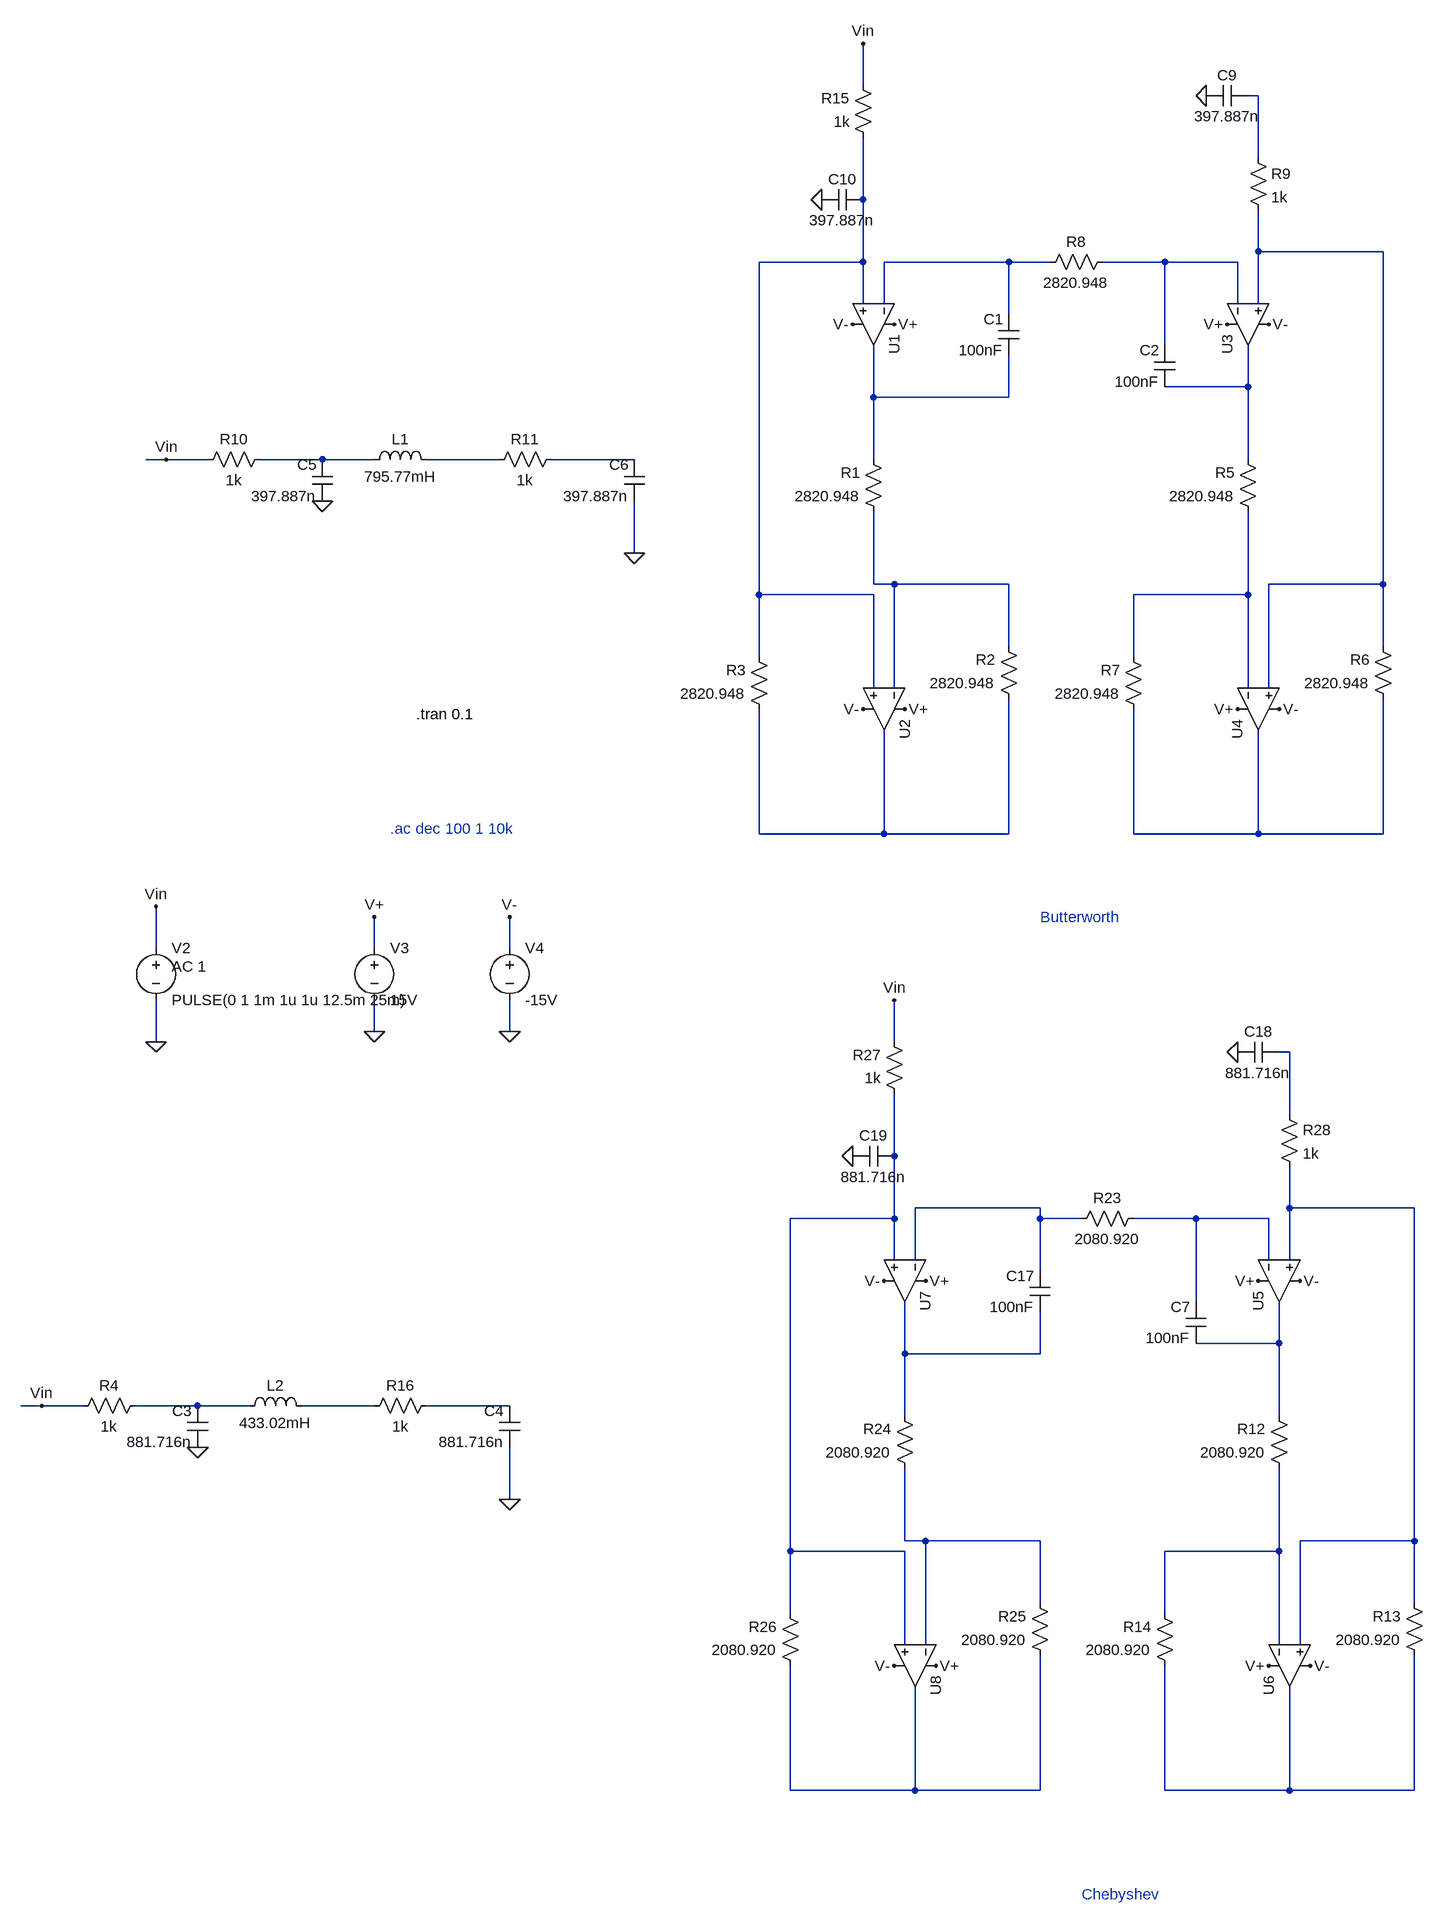
[diagram p0: schematic comparatie-impedanta.asc]
comparatie-impedanta.asc, the LTspice schematic file:
Version 4.1
SHEET 1 3224 1560
WIRE 240 -1312 240 -1376
WIRE 848 -1296 832 -1296
WIRE 848 -1200 848 -1296
WIRE 240 -1136 240 -1232
WIRE 848 -1056 848 -1120
WIRE 1040 -1056 848 -1056
WIRE 240 -1040 240 -1136
WIRE 240 -1040 80 -1040
WIRE 464 -1040 272 -1040
WIRE 528 -1040 464 -1040
WIRE 704 -1040 608 -1040
WIRE 816 -1040 704 -1040
WIRE 240 -976 240 -1040
WIRE 272 -976 272 -1040
WIRE 816 -976 816 -1040
WIRE 848 -976 848 -1056
WIRE 464 -960 464 -1040
WIRE 704 -912 704 -1040
WIRE 832 -848 832 -912
WIRE 832 -848 704 -848
WIRE 256 -832 256 -912
WIRE 464 -832 464 -896
WIRE 464 -832 256 -832
WIRE -832 -736 -864 -736
WIRE -768 -736 -832 -736
WIRE -592 -736 -688 -736
WIRE -512 -736 -592 -736
WIRE -320 -736 -432 -736
WIRE -112 -736 -240 -736
WIRE 256 -736 256 -832
WIRE 832 -736 832 -848
WIRE -112 -592 -112 -672
WIRE 256 -544 256 -656
WIRE 288 -544 256 -544
WIRE 464 -544 288 -544
WIRE 1040 -544 1040 -1056
WIRE 1040 -544 864 -544
WIRE 80 -528 80 -1040
WIRE 256 -528 80 -528
WIRE 832 -528 832 -656
WIRE 832 -528 656 -528
WIRE 464 -448 464 -544
WIRE 1040 -448 1040 -544
WIRE 80 -432 80 -528
WIRE 656 -432 656 -528
WIRE 256 -384 256 -528
WIRE 288 -384 288 -544
WIRE 832 -384 832 -528
WIRE 864 -384 864 -544
WIRE 80 -160 80 -352
WIRE 272 -160 272 -320
WIRE 272 -160 80 -160
WIRE 464 -160 464 -368
WIRE 464 -160 272 -160
WIRE 656 -160 656 -352
WIRE 848 -160 848 -320
WIRE 848 -160 656 -160
WIRE 1040 -160 1040 -368
WIRE 1040 -160 848 -160
WIRE -848 16 -848 -48
WIRE -512 16 -512 -32
WIRE -304 16 -304 -32
WIRE -512 144 -512 96
WIRE -304 144 -304 96
WIRE -848 160 -848 96
WIRE 288 160 288 96
WIRE 896 176 880 176
WIRE 896 272 896 176
WIRE 288 336 288 240
WIRE 512 416 320 416
WIRE 896 416 896 352
WIRE 1088 416 896 416
WIRE 288 432 288 336
WIRE 288 432 128 432
WIRE 512 432 512 416
WIRE 576 432 512 432
WIRE 752 432 656 432
WIRE 864 432 752 432
WIRE 288 496 288 432
WIRE 320 496 320 416
WIRE 864 496 864 432
WIRE 896 496 896 416
WIRE 512 512 512 432
WIRE 752 560 752 432
WIRE 880 624 880 560
WIRE 880 624 752 624
WIRE 304 640 304 560
WIRE 512 640 512 576
WIRE 512 640 304 640
WIRE -1024 720 -1056 720
WIRE -960 720 -1024 720
WIRE -784 720 -880 720
WIRE -704 720 -784 720
WIRE -512 720 -624 720
WIRE -304 720 -432 720
WIRE 304 736 304 640
WIRE 880 736 880 624
WIRE -304 864 -304 784
WIRE 304 928 304 816
WIRE 336 928 304 928
WIRE 512 928 336 928
WIRE 1088 928 1088 416
WIRE 1088 928 912 928
WIRE 128 944 128 432
WIRE 304 944 128 944
WIRE 880 944 880 816
WIRE 880 944 704 944
WIRE 512 1024 512 928
WIRE 1088 1024 1088 928
WIRE 128 1040 128 944
WIRE 704 1040 704 944
WIRE 304 1088 304 944
WIRE 336 1088 336 928
WIRE 880 1088 880 944
WIRE 912 1088 912 928
WIRE 128 1312 128 1120
WIRE 320 1312 320 1152
WIRE 320 1312 128 1312
WIRE 512 1312 512 1104
WIRE 512 1312 320 1312
WIRE 704 1312 704 1120
WIRE 896 1312 896 1152
WIRE 896 1312 704 1312
WIRE 1088 1312 1088 1104
WIRE 1088 1312 896 1312
FLAG -512 144 0
FLAG -304 144 0
FLAG -512 -32 V+
FLAG -304 -32 V-
FLAG -112 -592 0
FLAG 816 -352 V+
FLAG 800 -944 V+
FLAG 880 -352 V-
FLAG 864 -944 V-
FLAG 304 -352 V+
FLAG 288 -944 V+
FLAG 240 -352 V-
FLAG 224 -944 V-
FLAG 768 -1296 0
FLAG 176 -1136 0
FLAG -592 -672 0
FLAG 240 -1376 Vin
FLAG -848 160 0
FLAG -848 -48 Vin
FLAG -832 -736 Vin
FLAG 864 1120 V+
FLAG 848 528 V+
FLAG 928 1120 V-
FLAG 912 528 V-
FLAG 352 1120 V+
FLAG 336 528 V+
FLAG 288 1120 V-
FLAG 272 528 V-
FLAG 816 176 0
FLAG 224 336 0
FLAG 288 96 Vin
FLAG -304 864 0
FLAG -784 784 0
FLAG -1024 720 Vin
SYMBOL voltage -512 0 R0
WINDOW 123 0 0 Left 0
WINDOW 39 0 0 Left 0
SYMATTR InstName V3
SYMATTR Value 15V
SYMBOL voltage -304 0 R0
WINDOW 123 0 0 Left 0
WINDOW 39 0 0 Left 0
SYMATTR InstName V4
SYMATTR Value -15V
SYMBOL ind -528 -720 R270
WINDOW 0 32 56 VTop 2
WINDOW 3 5 56 VBottom 2
SYMATTR InstName L1
SYMATTR Value 795.77mH
SYMBOL res 848 -640 R180
WINDOW 0 36 76 Left 2
WINDOW 3 36 40 Left 2
SYMATTR InstName R5
SYMATTR Value 2820.948
SYMBOL res 1056 -352 R180
WINDOW 0 36 76 Left 2
WINDOW 3 36 40 Left 2
SYMATTR InstName R6
SYMATTR Value 2820.948
SYMBOL res 672 -336 R180
WINDOW 0 36 76 Left 2
WINDOW 3 36 40 Left 2
SYMATTR InstName R7
SYMATTR Value 2820.948
SYMBOL res 624 -1056 R90
WINDOW 0 0 56 VBottom 2
WINDOW 3 32 56 VTop 2
SYMATTR InstName R8
SYMATTR Value 2820.948
SYMBOL cap 720 -848 R180
WINDOW 0 24 56 Left 2
WINDOW 3 24 8 Left 2
SYMATTR InstName C2
SYMATTR Value 100nF
SYMBOL OpAmps\\UniversalOpAmp2 832 -944 M90
SYMATTR InstName U3
SYMBOL cap -576 -672 R180
WINDOW 0 24 56 Left 2
WINDOW 3 24 8 Left 2
SYMATTR InstName C5
SYMATTR Value 397.887n
SYMBOL cap -96 -672 R180
WINDOW 0 24 56 Left 2
WINDOW 3 24 8 Left 2
SYMATTR InstName C6
SYMATTR Value 397.887n
SYMBOL OpAmps\\UniversalOpAmp2 848 -352 M90
SYMATTR InstName U4
SYMBOL res 272 -640 R180
WINDOW 0 36 76 Left 2
WINDOW 3 36 40 Left 2
SYMATTR InstName R1
SYMATTR Value 2820.948
SYMBOL res 480 -352 R180
WINDOW 0 36 76 Left 2
WINDOW 3 36 40 Left 2
SYMATTR InstName R2
SYMATTR Value 2820.948
SYMBOL res 96 -336 R180
WINDOW 0 36 76 Left 2
WINDOW 3 36 40 Left 2
SYMATTR InstName R3
SYMATTR Value 2820.948
SYMBOL cap 480 -896 R180
WINDOW 0 24 56 Left 2
WINDOW 3 24 8 Left 2
SYMATTR InstName C1
SYMATTR Value 100nF
SYMBOL OpAmps\\UniversalOpAmp2 256 -944 R90
SYMATTR InstName U1
SYMBOL OpAmps\\UniversalOpAmp2 272 -352 R90
SYMATTR InstName U2
SYMBOL res 256 -1216 R180
WINDOW 0 36 76 Left 2
WINDOW 3 36 40 Left 2
SYMATTR InstName R15
SYMATTR Value 1k
SYMBOL cap 832 -1312 R90
WINDOW 0 0 32 VBottom 2
WINDOW 3 32 32 VTop 2
SYMATTR InstName C9
SYMATTR Value 397.887n
SYMBOL cap 240 -1152 R90
WINDOW 0 0 32 VBottom 2
WINDOW 3 32 32 VTop 2
SYMATTR InstName C10
SYMATTR Value 397.887n
SYMBOL voltage -848 0 R0
WINDOW 123 24 44 Left 2
WINDOW 39 0 0 Left 0
SYMATTR Value2 AC 1
SYMATTR InstName V2
SYMATTR Value PULSE(0 1 1m 1u 1u 12.5m 25m)
SYMBOL res 832 -1216 R0
SYMATTR InstName R9
SYMATTR Value 1k
SYMBOL res -672 -752 R90
WINDOW 0 0 56 VBottom 2
WINDOW 3 32 56 VTop 2
SYMATTR InstName R10
SYMATTR Value 1k
SYMBOL res -224 -752 R90
WINDOW 0 0 56 VBottom 2
WINDOW 3 32 56 VTop 2
SYMATTR InstName R11
SYMATTR Value 1k
SYMBOL res 896 832 R180
WINDOW 0 36 76 Left 2
WINDOW 3 36 40 Left 2
SYMATTR InstName R12
SYMATTR Value 2080.920
SYMBOL res 1104 1120 R180
WINDOW 0 36 76 Left 2
WINDOW 3 36 40 Left 2
SYMATTR InstName R13
SYMATTR Value 2080.920
SYMBOL res 720 1136 R180
WINDOW 0 36 76 Left 2
WINDOW 3 36 40 Left 2
SYMATTR InstName R14
SYMATTR Value 2080.920
SYMBOL res 672 416 R90
WINDOW 0 0 56 VBottom 2
WINDOW 3 32 56 VTop 2
SYMATTR InstName R23
SYMATTR Value 2080.920
SYMBOL cap 768 624 R180
WINDOW 0 24 56 Left 2
WINDOW 3 24 8 Left 2
SYMATTR InstName C7
SYMATTR Value 100nF
SYMBOL OpAmps\\UniversalOpAmp2 880 528 M90
SYMATTR InstName U5
SYMBOL OpAmps\\UniversalOpAmp2 896 1120 M90
SYMATTR InstName U6
SYMBOL res 320 832 R180
WINDOW 0 36 76 Left 2
WINDOW 3 36 40 Left 2
SYMATTR InstName R24
SYMATTR Value 2080.920
SYMBOL res 528 1120 R180
WINDOW 0 36 76 Left 2
WINDOW 3 36 40 Left 2
SYMATTR InstName R25
SYMATTR Value 2080.920
SYMBOL res 144 1136 R180
WINDOW 0 36 76 Left 2
WINDOW 3 36 40 Left 2
SYMATTR InstName R26
SYMATTR Value 2080.920
SYMBOL cap 528 576 R180
WINDOW 0 24 56 Left 2
WINDOW 3 24 8 Left 2
SYMATTR InstName C17
SYMATTR Value 100nF
SYMBOL OpAmps\\UniversalOpAmp2 304 528 R90
SYMATTR InstName U7
SYMBOL OpAmps\\UniversalOpAmp2 320 1120 R90
SYMATTR InstName U8
SYMBOL res 304 256 R180
WINDOW 0 36 76 Left 2
WINDOW 3 36 40 Left 2
SYMATTR InstName R27
SYMATTR Value 1k
SYMBOL cap 880 160 R90
WINDOW 0 0 32 VBottom 2
WINDOW 3 32 32 VTop 2
SYMATTR InstName C18
SYMATTR Value 881.716n
SYMBOL cap 288 320 R90
WINDOW 0 0 32 VBottom 2
WINDOW 3 32 32 VTop 2
SYMATTR InstName C19
SYMATTR Value 881.716n
SYMBOL res 880 256 R0
SYMATTR InstName R28
SYMATTR Value 1k
SYMBOL ind -720 736 R270
WINDOW 0 32 56 VTop 2
WINDOW 3 5 56 VBottom 2
SYMATTR InstName L2
SYMATTR Value 433.02mH
SYMBOL cap -768 784 R180
WINDOW 0 24 56 Left 2
WINDOW 3 24 8 Left 2
SYMATTR InstName C3
SYMATTR Value 881.716n
SYMBOL cap -288 784 R180
WINDOW 0 24 56 Left 2
WINDOW 3 24 8 Left 2
SYMATTR InstName C4
SYMATTR Value 881.716n
SYMBOL res -864 704 R90
WINDOW 0 0 56 VBottom 2
WINDOW 3 32 56 VTop 2
SYMATTR InstName R4
SYMATTR Value 1k
SYMBOL res -416 704 R90
WINDOW 0 0 56 VBottom 2
WINDOW 3 32 56 VTop 2
SYMATTR InstName R16
SYMATTR Value 1k
TEXT -488 -168 Left 2 ;.ac dec 100 1 10k
TEXT 512 -32 Left 2 ;Butterworth
TEXT 576 1472 Left 2 ;Chebyshev
TEXT -448 -344 Left 2 !.tran 0.1

The netlist it stands for:
* comparatie-impedanta.asc
V3 V+ 0 15V
V4 V- 0 -15V
L1 N008 N009 795.77mH
R5 N012 N006 2820.948
R6 N014 N003 2820.948
R7 N014 N012 2820.948
R8 N005 N004 2820.948
C2 N006 N005 100nF
X§U3 N003 N005 V+ V- N006 level2 Avol=1Meg GBW=10Meg Slew=10Meg Ilimit=25m Rail=0 Vos=0 En=0 Enk=0 In=0 Ink=0 Rin=500Meg  ; pins In+ In- V+ V- OUT
C5 0 N008 397.887n
C6 0 N010 397.887n
X§U4 N003 N012 V+ V- N014 level2 Avol=1Meg GBW=10Meg Slew=10Meg Ilimit=25m Rail=0 Vos=0 En=0 Enk=0 In=0 Ink=0 Rin=500Meg  ; pins In+ In- V+ V- OUT
R1 N011 N007 2820.948
R2 N013 N011 2820.948
R3 N013 N002 2820.948
C1 N007 N004 100nF
X§U1 N002 N004 V+ V- N007 level2 Avol=1Meg GBW=10Meg Slew=10Meg Ilimit=25m Rail=0 Vos=0 En=0 Enk=0 In=0 Ink=0 Rin=500Meg  ; pins In+ In- V+ V- OUT
X§U2 N002 N011 V+ V- N013 level2 Avol=1Meg GBW=10Meg Slew=10Meg Ilimit=25m Rail=0 Vos=0 En=0 Enk=0 In=0 Ink=0 Rin=500Meg  ; pins In+ In- V+ V- OUT
R15 N002 Vin 1k
C9 N001 0 397.887n
C10 N002 0 397.887n
V2 Vin 0 PULSE(0 1 1m 1u 1u 12.5m 25m) AC 1
R9 N001 N003 1k
R10 N008 Vin 1k
R11 N010 N009 1k
R12 N026 N020 2080.920
R13 N028 N018 2080.920
R14 N028 N026 2080.920
R23 N019 N017 2080.920
C7 N020 N019 100nF
X§U5 N018 N019 V+ V- N020 level2 Avol=1Meg GBW=10Meg Slew=10Meg Ilimit=25m Rail=0 Vos=0 En=0 Enk=0 In=0 Ink=0 Rin=500Meg  ; pins In+ In- V+ V- OUT
X§U6 N018 N026 V+ V- N028 level2 Avol=1Meg GBW=10Meg Slew=10Meg Ilimit=25m Rail=0 Vos=0 En=0 Enk=0 In=0 Ink=0 Rin=500Meg  ; pins In+ In- V+ V- OUT
R24 N025 N021 2080.920
R25 N027 N025 2080.920
R26 N027 N016 2080.920
C17 N021 N017 100nF
X§U7 N016 N017 V+ V- N021 level2 Avol=1Meg GBW=10Meg Slew=10Meg Ilimit=25m Rail=0 Vos=0 En=0 Enk=0 In=0 Ink=0 Rin=500Meg  ; pins In+ In- V+ V- OUT
X§U8 N016 N025 V+ V- N027 level2 Avol=1Meg GBW=10Meg Slew=10Meg Ilimit=25m Rail=0 Vos=0 En=0 Enk=0 In=0 Ink=0 Rin=500Meg  ; pins In+ In- V+ V- OUT
R27 N016 Vin 1k
C18 N015 0 881.716n
C19 N016 0 881.716n
R28 N015 N018 1k
L2 N022 N023 433.02mH
C3 0 N022 881.716n
C4 0 N024 881.716n
R4 N022 Vin 1k
R16 N024 N023 1k
* .ac dec 100 1 10k
* Butterworth
* Chebyshev
.tran 0.1
.lib UniversalOpAmp2.lib
.backanno
.end